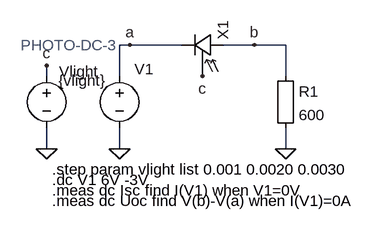
[diagram p0: schematic PHOTO-DC-3.asc]
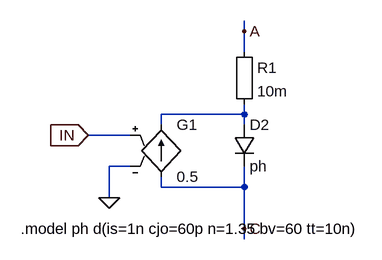
[diagram p1: sub-circuit photodiode.asc]
PHOTO-DC-3.asc, the LTspice schematic file:
Version 4
SHEET 1 880 680
WIRE -64 160 -80 160
WIRE 16 160 -64 160
WIRE 128 160 80 160
WIRE 176 160 128 160
WIRE -192 208 -192 192
WIRE -80 208 -80 160
WIRE 176 208 176 160
WIRE -192 320 -192 288
WIRE -80 320 -80 288
WIRE 176 320 176 288
FLAG -192 320 0
FLAG -80 320 0
FLAG 176 320 0
FLAG 128 160 b
FLAG -64 160 a
FLAG -192 192 c
FLAG 48 208 c
SYMBOL voltage -192 192 R0
WINDOW 0 19 9 Left 2
WINDOW 3 18 23 Left 2
WINDOW 123 0 0 Left 2
WINDOW 39 0 0 Left 2
SYMATTR InstName Vlight
SYMATTR Value {vlight}
SYMBOL photodiode 80 176 M270
SYMATTR InstName X1
SYMBOL voltage -80 192 R0
WINDOW 3 24 32 Invisible 2
WINDOW 123 0 0 Left 2
WINDOW 39 0 0 Left 2
WINDOW 0 23 5 Left 2
SYMATTR Value 0
SYMATTR InstName V1
SYMBOL Misc\\EuropeanResistor 160 192 R0
SYMATTR InstName R1
SYMATTR Value 600
TEXT -184 368 Left 2 !.dc V1 6V -3V
TEXT -184 352 Left 2 !.step param vlight list 0.001 0.0020 0.0030
TEXT -184 384 Left 2 !.meas dc Isc find I(V1) when V1=0V
TEXT -184 400 Left 2 !.meas dc Uoc find V(b)-V(a) when I(V1)=0A
TEXT -232 160 Left 2 ;PHOTO-DC-3

photodiode.asc, the sub-circuit schematic file:
Version 4
SHEET 1 880 680
WIRE 80 32 80 16
WIRE 80 64 80 32
WIRE 80 160 80 144
WIRE 80 160 -48 160
WIRE -48 176 -48 160
WIRE 80 176 80 160
WIRE -96 192 -160 192
WIRE -96 240 -128 240
WIRE -48 272 -48 256
WIRE 80 272 80 240
WIRE 80 272 -48 272
WIRE -128 288 -128 240
WIRE 80 336 80 272
WIRE 80 352 80 336
FLAG -128 288 0
FLAG 80 32 A
FLAG 80 336 C
FLAG -160 192 IN
IOPIN -160 192 In
SYMBOL Misc\\EuropeanResistor 64 48 R0
SYMATTR InstName R1
SYMATTR Value 10m
SYMBOL g -48 160 R0
SYMATTR InstName G1
SYMATTR Value 0.5
SYMBOL diode 64 176 R0
SYMATTR InstName D2
SYMATTR Value ph
TEXT -264 336 Left 2 !.model ph d(is=1n cjo=60p n=1.35 bv=60 tt=10n)

The netlist it stands for:
* PHOTO-DC-3.asc
Vlight c 0 {vlight}
XX1 b a c photodiode
V1 a 0 0
R1 b 0 600

* block symbol definitions
.subckt photodiode A C IN
R1 A N001 10m
G1 C N001 IN 0 0.5
D2 N001 C ph
.model ph d(is=1n cjo=60p n=1.35 bv=60 tt=10n)
.ends photodiode

.model D D
.lib standard.dio
.dc V1 6V -3V
.step param vlight list 0.001 0.0020 0.0030
.meas dc Isc find I(V1) when V1=0V
.meas dc Uoc find V(b)-V(a) when I(V1)=0A
* PHOTO-DC-3
.backanno
.end